# EAGLE design loiterboard (EAGLE 9.1.1)
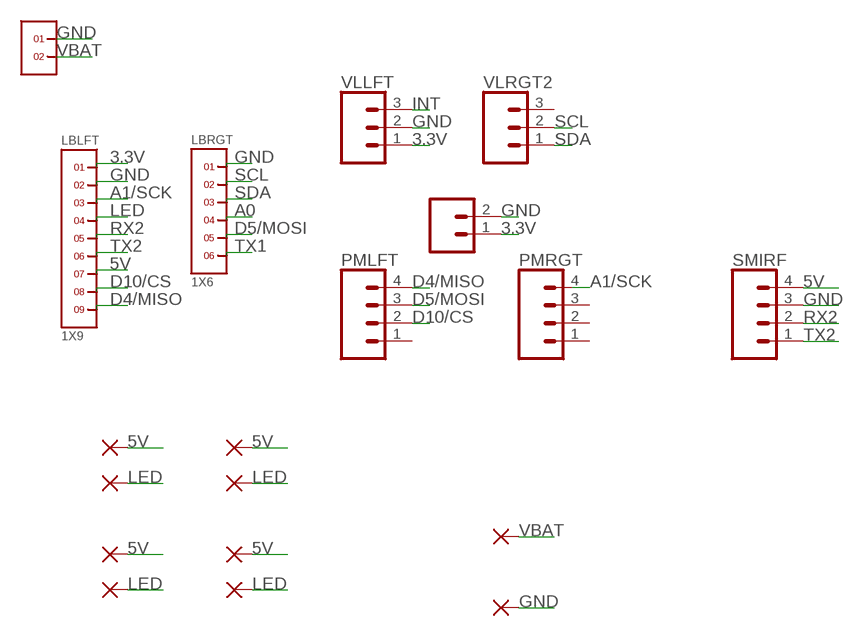
[diagram p0: schematic, sheet 1]

## Parts
LBLFT  1X9  [1X9]
LBRGT  1X6  [1X6]
PAD1  SMD2  [SMD1,27-2,54]
PAD2  SMD2  [SMD1,27-2,54]
PAD3  SMD2  [SMD1,27-2,54]
PAD4  SMD2  [SMD1,27-2,54]
PAD5  SMD2  [SMD1,27-2,54]
PAD6  LED  SMD2  [SMD1,27-2,54]
PAD7  SMD2  [SMD1,27-2,54]
PAD8  SMD2  [SMD1,27-2,54]
PAD9  SMD2  [SMD1,27-2,54]
PAD10  SMD2  [SMD1,27-2,54]
PMLFT  CONN_04  [1X04]
PMRGT  CONN_04  [1X04]
PWPWR  CONN_02  [1X02]
SMIRF  CONN_04  [1X04]
U$1  1X2  [1X2]
VLLFT  CONN_03  [1X03]
VLRGT2  CONN_03  [1X03]

## Nets
3.3V: LBLFT.1 PWPWR.1 VLLFT.1
5V: LBLFT.7 PAD1.1(P) PAD3.1(P) PAD5.1(P) PAD7.1(P) SMIRF.4
A0: LBRGT.4
A1/SCK: LBLFT.3 PMRGT.4
D4/MISO: LBLFT.9 PMLFT.4
D5/MOSI: LBRGT.5 PMLFT.3
D10/CS: LBLFT.8 PMLFT.2
GND: LBLFT.2 LBRGT.1 PAD10.1(P) PWPWR.2 SMIRF.3 U$1.1 VLLFT.2
INT: VLLFT.3
LED: LBLFT.4 PAD2.1(P) PAD4.1(P) PAD6.1(P) PAD8.1(P)
RX2: LBLFT.5 SMIRF.2
SCL: LBRGT.2 VLRGT2.2
SDA: LBRGT.3 VLRGT2.1
TX1: LBRGT.6
TX2: LBLFT.6 SMIRF.1
VBAT: PAD9.1(P) U$1.2
Unconnected: PMLFT.1 PMRGT.1 PMRGT.2 PMRGT.3 VLRGT2.3

## Library data of the parts
LBLFT = headers(2mm):1X9
LBRGT = headers(2mm):1X6
PAD1-PAD10 = wirepad:SMD2: SMD PAD
PMLFT PMRGT SMIRF = SparkFun-Connectors:CONN_04: Multi connection point. Often used as Generic Header-pin footprint for 0.1 inch spaced/style header connections On any of the 0.1 inch spaced packages, you can populate with these: Break Away Headers - Straight <https://www.sparkfun.com/products/116> (PRT-00116) Break Away Male Headers - Right Angle <https://www.sparkfun.com/products/553> (PRT-00553) Female Headers <https://www.sparkfun.com/products/115> (PRT-00115) Break Away Headers - Machine Pin <https://www.sparkfun.com/products/117> (PRT-00117) Break Away Female Headers - Swiss Machine Pin <https://www.sparkfun.com/products/743> (PRT-00743) For SCREWTERMINALS and SPRING TERMINALS visit here: Screw Terimnals on SparkFun.com <https://www.sparkfun.com/search/results?term=Screw+Terminals> (5mm/3.5mm/2.54mm spacing) This device is also useful as a general connection point to wire up your design to another part of your project. Our various solder wires solder well into these plated through hole pads. Hook-Up Wire - Assortment (Stranded, 22 AWG) <https://www.sparkfun.com/products/11375> (PRT-11375) Hook-Up Wire - Assortment (Solid Core, 22 AWG) <https://www.sparkfun.com/products/11367> (PRT-11367) View the entire wire category on our website here <https://www.sparkfun.com/categories/141> Special notes: Molex polarized connector foot print use with SKU : PRT-08231 with associated crimp pins and housings. 1MM SMD Version SKU: PRT-10208; PROD_ID: CONN-09696
PWPWR = SparkFun-Connectors:CONN_02: Multi connection point. Often used as Generic Header-pin footprint for 0.1 inch spaced/style header connections On any of the 0.1 inch spaced packages, you can populate with these: Break Away Headers - Straight <https://www.sparkfun.com/products/116> (PRT-00116) Break Away Male Headers - Right Angle <https://www.sparkfun.com/products/553> (PRT-00553) Female Headers <https://www.sparkfun.com/products/115> (PRT-00115) Break Away Headers - Machine Pin <https://www.sparkfun.com/products/117> (PRT-00117) Break Away Female Headers - Swiss Machine Pin <https://www.sparkfun.com/products/743> (PRT-00743) For SCREWTERMINALS and SPRING TERMINALS visit here: Screw Terimnals on SparkFun.com <https://www.sparkfun.com/search/results?term=Screw+Terminals> (5mm/3.5mm/2.54mm spacing) This device is also useful as a general connection point to wire up your design to another part of your project. Our various solder wires solder well into these plated through hole pads. Hook-Up Wire - Assortment (Stranded, 22 AWG) <https://www.sparkfun.com/products/11375> (PRT-11375) Hook-Up Wire - Assortment (Solid Core, 22 AWG) <https://www.sparkfun.com/products/11367> (PRT-11367) View the entire wire category on our website here <https://www.sparkfun.com/categories/141> Special notes: Molex polarized connector foot print use with: PRT-08233 with associated crimp pins and housings. 2.54_SCREWTERM for use with PRT-10571. 3.5mm Screw Terminal footprints for PRT-08084 5mm Screw Terminal footprints for use with PRT-08432
U$1 = headers(2mm):1X2
VLLFT VLRGT2 = SparkFun-Connectors:CONN_03: Multi connection point. Often used as Generic Header-pin footprint for 0.1 inch spaced/style header connections On any of the 0.1 inch spaced packages, you can populate with these: Break Away Headers - Straight <https://www.sparkfun.com/products/116> (PRT-00116) Break Away Male Headers - Right Angle <https://www.sparkfun.com/products/553> (PRT-00553) Female Headers <https://www.sparkfun.com/products/115> (PRT-00115) Break Away Headers - Machine Pin <https://www.sparkfun.com/products/117> (PRT-00117) Break Away Female Headers - Swiss Machine Pin <https://www.sparkfun.com/products/743> (PRT-00743) Stackable Header - 3 Pin (Female, 0.1") <https://www.sparkfun.com/products/13875> (PRT-13875) For SCREWTERMINALS and SPRING TERMINALS visit here: Screw Terimnals on SparkFun.com <https://www.sparkfun.com/search/results?term=Screw+Terminals> (5mm/3.5mm/2.54mm spacing) This device is also useful as a general connection point to wire up your design to another part of your project. Our various solder wires solder well into these plated through hole pads. Hook-Up Wire - Assortment (Stranded, 22 AWG) <https://www.sparkfun.com/products/11375> (PRT-11375) Hook-Up Wire - Assortment (Solid Core, 22 AWG) <https://www.sparkfun.com/products/11367> (PRT-11367) View the entire wire category on our website here <https://www.sparkfun.com/categories/141> Special notes: Molex polarized connector foot print use with SKU : PRT-08232 with associated crimp pins and housings.

## Board
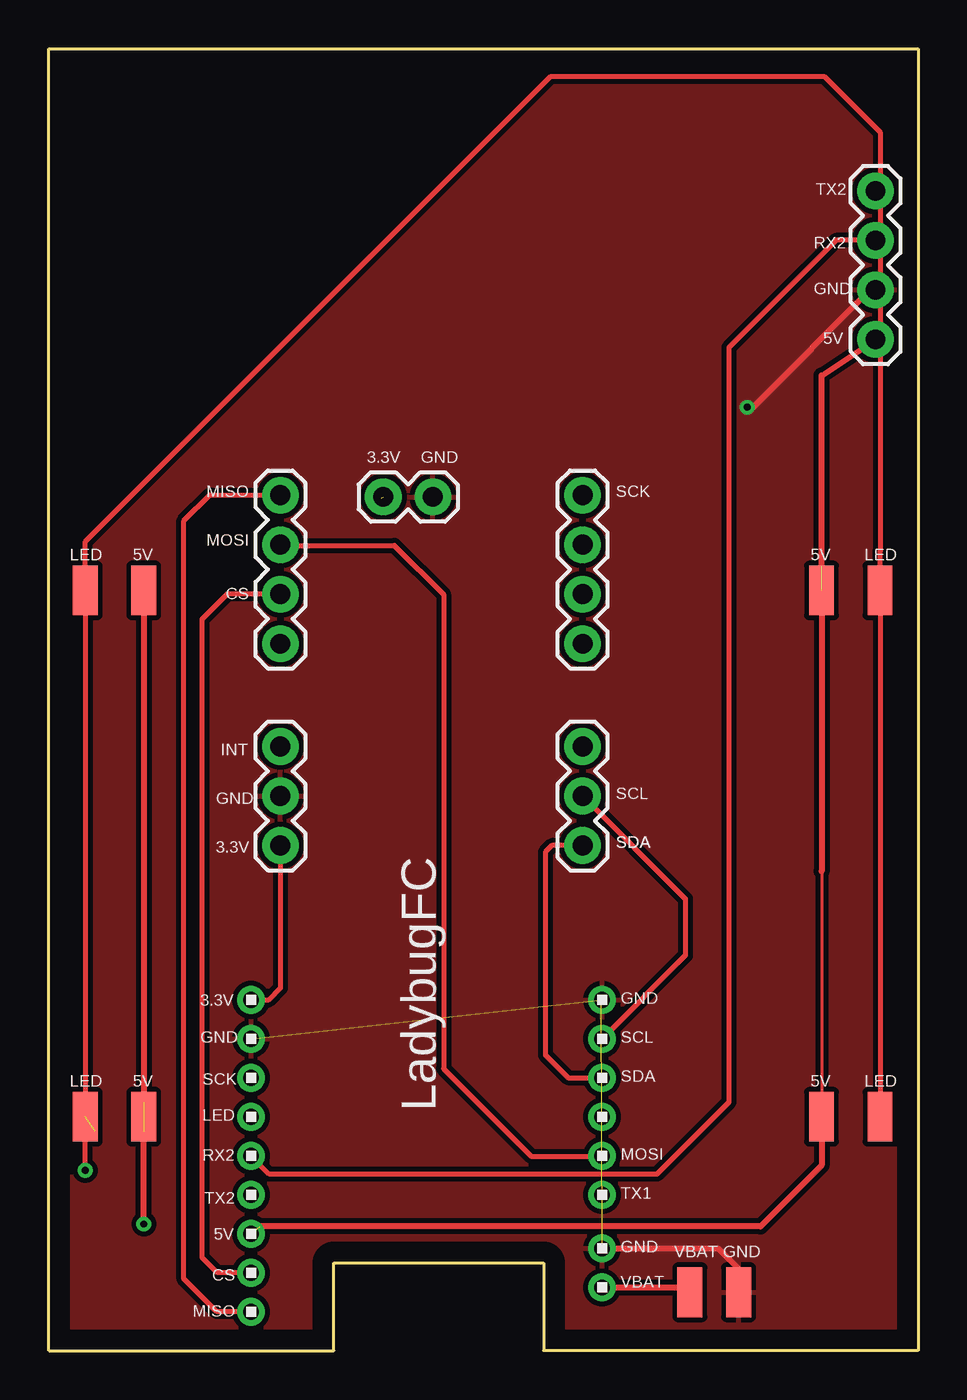
[diagram p1: board, top side]
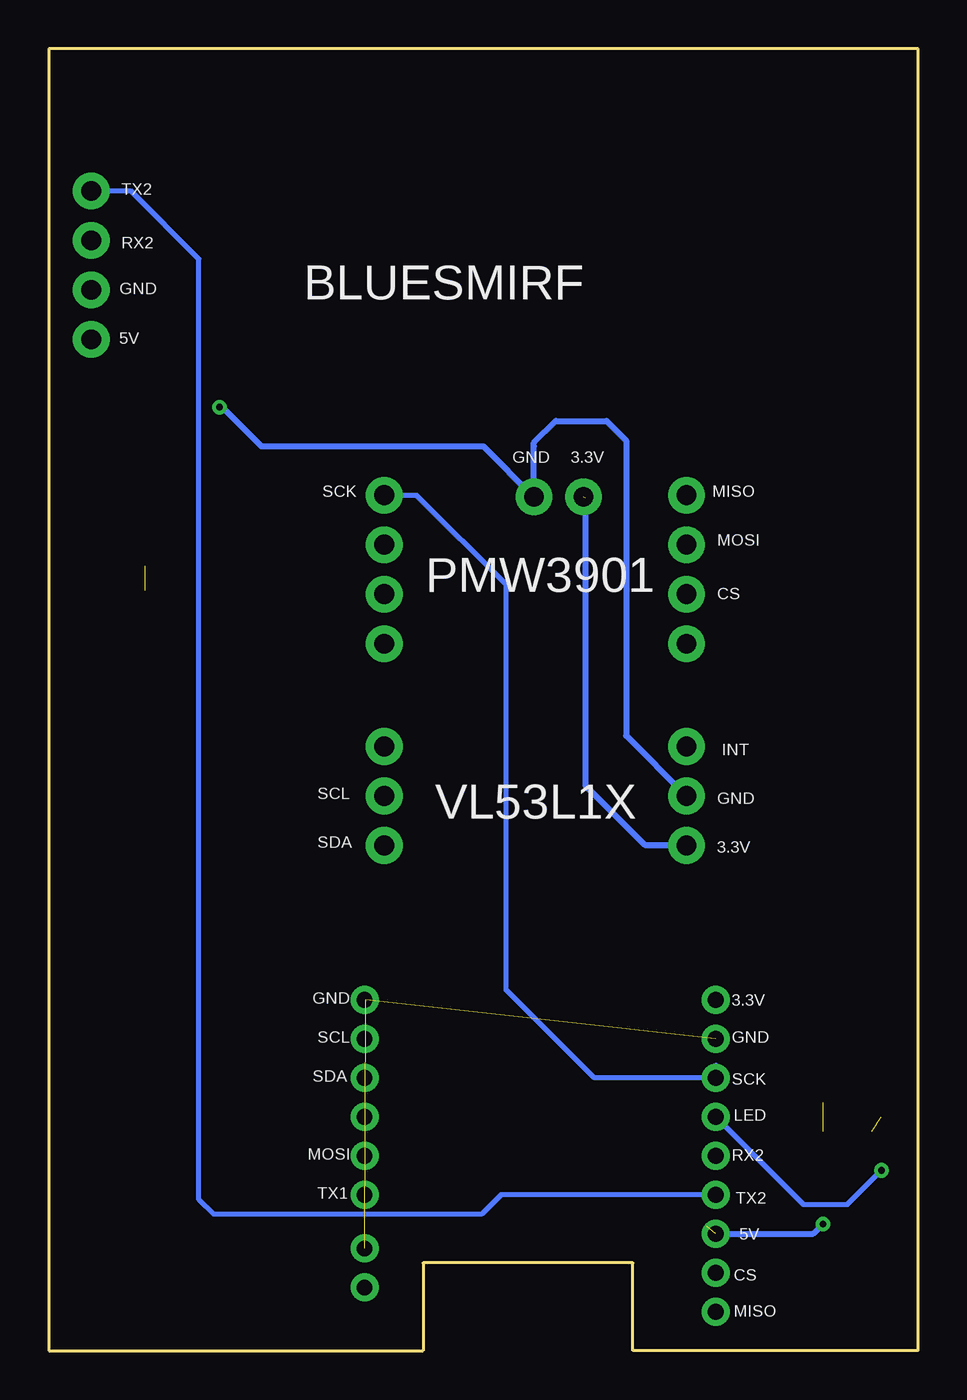
[diagram p2: board, bottom side, seen from below]

Size 44.58 x 66.79 mm. Coordinates in mm from the lower left corner, seen from the top.
Outline: 0,0 0,66.79 44.58,66.79 44.58,0 25.38,0 25.38,4.5 14.63,4.5 14.63,0 0,0
Copper layers (1*16): Top 0.035mm / dielectric 1.5mm / Bottom 0.035mm
Design rules "default": minimum track width 6mil, minimum drill 0.35mm, track to track 6mil, track to pad 6mil, pad to pad 6mil, via to via 6mil, smd to smd 6mil, copper to edge 40mil, drill to drill 6mil, minimum pad ring 10mil, minimum via ring 8mil, stop-mask expansion 4mil, vias tented up to drill 0mil, thermal gap 10mil

### Footprints (pad centres in the part's own frame; a part is rotated, then mirrored left to right if it is on the bottom)
1X9 = drill 0.8 pad 1.422: 1 -8,0; 2 -6,0; 3 -4,0; 4 -2,0; 5 0,0; 6 2,0; 7 4,0; 8 6,0; 9 8,0
1X6 = drill 0.8 pad 1.422: 1 -5,0; 2 -3,0; 3 -1,0; 4 1,0; 5 3,0; 6 5,0
SMD1,27-2,54 = smd 1.27 x 2.54: 1 0,0
1X04 = drill 1.016 pad 1.88: 1 0,0; 2 2.54,0; 3 5.08,0; 4 7.62,0
1X02 = drill 1.016 pad 1.88: 1 0,0; 2 2.54,0
1X2 = drill 0.8 pad 1.422: 1 -1,0; 2 1,0
1X03 = drill 1.016 pad 1.88: 1 0,0; 2 2.54,0; 3 5.08,0

### Placement (x,y rotation side)
LBLFT  10.38,10 270 top
LBRGT  28.38,13 270 top
PAD1  4.88,12 0 top
PAD2  1.88,12 0 top
PAD3  39.63,12 0 top
PAD4  42.63,12 0 top
PAD5  4.88,39 0 top
PAD6  1.88,39 0 top
PAD7  39.63,39 0 top
PAD8  42.63,39 0 top
PAD9  32.88,3 180 top
PAD10  35.38,3 180 top
PMLFT  11.88,36.27 90 top
PMRGT  27.38,36.27 90 top
PWPWR  17.16,43.8 0 top
SMIRF  42.4,59.5 270 top
U$1  28.38,4.25 270 top
VLLFT  11.88,25.92 90 top
VLRGT2  27.38,25.92 90 top

### Tracks (layer width: path | path; a pad name or v marks a point on that pad's centre or on a via)
3.3V  (1 unrouted)
  Top 0.254: VLLFT.1 11.88,18.61 11.25,17.98 10.39,17.98 LBLFT.1
  Bottom 0.152: 11.87,26.07 VLLFT.1
  Bottom 0.254: 11.91,25.96 VLLFT.1
  Bottom 0.305: 17.05,43.75 17.05,28.99 14.02,25.96 11.91,25.96
5V  (via drill 0.35)  (4 unrouted)
  Top 0.152: 39.63,24.6 PAD3.1
  Top 0.305: 39.63,40.25 39.63,50.03 SMIRF.4 | 10.84,6.38 36.51,6.38 39.63,9.5 PAD3.1 | PAD5.1 4.88,12.75 | v4.88,6.5 4.88,11.25 | PAD7.1 39.63,24.6
  Bottom 0.305: LBLFT.7 5.38,6 v4.88,6.5
A1/SCK
  Bottom 0.152: 10.35,14.03 LBLFT.3 | 27.26,43.75 PMRGT.4
  Bottom 0.254: 10.35,14.64 10.35,14.03 | LBLFT.3 16.62,14 21.13,18.51 21.13,39.3 25.7,43.88 27.36,43.88 PMRGT.4
D4/MISO  (via drill 0.35)
  Top 0.254: LBLFT.9 8.62,2 6.93,3.69 6.93,42.58 8.26,43.9 v11.86,43.9
  Bottom 0.254: v11.86,43.9 PMLFT.4
D5/MOSI
  Top 0.254: PMLFT.3 12.02,41.31 17.73,41.31 20.24,38.8 20.24,14.47 24.75,9.97 28.34,9.97 LBRGT.5
D10/CS
  Top 0.254: PMLFT.2 9.15,38.81 7.86,37.52 7.86,4.79 8.61,4.04 10.34,4.04 LBLFT.8
GND  (via drill 0.35)  (2 unrouted)
  Top 0.152: 28.33,17.99 LBRGT.1 | 42.14,54.42 42.27,54.42 | v35.82,48.4 36.12,48.4
  Top 0.305: U$1.1 34.33,5.25 35.58,4 | 36.12,48.4 42.14,54.42
  Bottom 0.305: VLLFT.2 14.98,31.56 14.98,46.7 15.98,47.7 18.58,47.7 19.7,46.58 19.7,46.4 PWPWR.2 22.3,46.4 33.68,46.4 35.68,48.4 v35.82,48.4
  pour Top (isolate 0.254): -0.38,66.86 45.27,66.86 45.27,-0.88 25.78,-0.88 25.78,4.95 14.6,4.95 14.6,-0.63 -0.38,-0.63
LED  (via drill 0.35)  (1 unrouted)
  Top 0.152: 1.88,10.75 2.38,11.25
  Top 0.254: PAD2.1 PAD6.1 1.88,41.5 25.75,65.37 39.75,65.37 42.63,62.5 42.63,41 PAD8.1 PAD4.1 | v1.88,9.25 1.88,10.75
  Bottom 0.254: LBLFT.4 5.88,7.5 3.63,7.5 v1.88,9.25
RX2
  Top 0.254: SMIRF.2 40.38,56.96 34.88,51.46 34.88,12.75 31.19,9.06 11.32,9.06 LBLFT.5
SCL
  Top 0.254: VLRGT2.2 32.65,23.19 32.65,20.27 LBRGT.2
SDA  (via drill 0.35)
  Top 0.254: VLRGT2.1 25.81,25.92 25.46,25.58 25.46,15.17 26.63,14 LBRGT.3
  Bottom 0.254: LBRGT.3
  other vias: 28.37,14
TX2
  Bottom 0.254: LBLFT.6 21.38,8 22.38,7 36.13,7 36.88,7.75 36.88,56 40.38,59.5 SMIRF.1
VBAT
  Top 0.152: 32.53,3.25 32.78,3
  Top 0.305: 32.38,3 32.78,3 PAD9.1 | U$1.2 32.53,3.25

### Text on the board
tPlace: 3.3V | GND | MISO | SCK | LED | 5V | MOSI | 5V | LED | CS | INT | GND | SCL | 3.3V | SDA | SDA | 3.3V | GND | GND | SCL | LED | 5V | SCK | SDA | 5V | LED | LED | LadybugFC | RX2 | MOSI | TX2 | TX1 | 5V | GND | VBAT | GND | CS | VBAT | MISO
bPlace: BLUESMIRF | 3.3V | GND | MISO | SCK | MOSI | CS | PMW3901 | INT | GND | SCL | VL53L1X | 3.3V | SDA | 3.3V | GND | GND | SCL | SCK | SDA | LED | RX2 | MOSI | TX2 | TX1 | 5V | CS | MISO
tNames: TX2 | RX2 | GND | 5V
bNames: TX2 | RX2 | GND | 5V